# Altium schematic sheet Estacion_Meteorologica_Sensor_BH1750.SchDoc
size A4; SheetNumber: 2; SheetTotal: 4
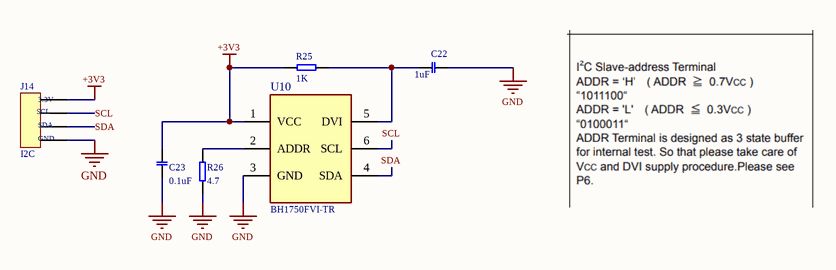
[diagram p0: Estacion_Meteorologica_Sensor_BH1750.SchDoc]

## Parts
C22  1uF  [CAPCP1608_0603]
C23  0.1uF  [CAPCP1608_0603]
J14  I2C  [HDR1X4]
R25  1K  [RESC1608_0603]
R26  4.7  [RESC1608_0603]
U10  BH1750FVI-TR  [XDCR_BH1750FVI-TR]

## Nets
+3V3: C23.2 J14.1 R25.1 U10.1(VCC)
GND: C22.2 C23.1 J14.4 R26.1 U10.3(GND)
SCL: J14.2 U10.6(SCL)
SDA: J14.3 U10.4(SDA)
NetC22_1: C22.1 R25.2 U10.5(DVI)
NetR26_2: R26.2 U10.2(ADDR)

## Notes on the sheet
- (in symbol Connector_04) 3.3V; SCL; SDA; GND

## Library data of the parts
C22 = C0603X105J4RACTU: Capacitor_1uF_0603
C23 = 06035C104K4T4A: Capacitor_0.1uF_0603
J14 = Connector_04
R25 = RCA06031K00JNEA: Resistencia_1K_0603
R26 = RCA06034K70FKEA: Resistencia_4.7K_0603
U10 = BH1750FVI-TR: Optical Sensor Ambient 560nm IÂ²C 6-SMD, Flat Lead Exposed Pad; MF: Rohm; Value: *; SnapEDA_Link: https://www.snapeda.com/parts/BH1750FVI-TR/Rohm/view-part/?ref=snap; Purchase-URL: https://pricing.snapeda.com/search/part/BH1750FVI-TR/?ref=eda; Availability: In Stock; Price: None; Package: SMD-6 ROHM Semiconductor; Check_prices: https://www.snapeda.com/parts/BH1750FVI-TR/Rohm/view-part/?ref=eda; MP: BH1750FVI-TR